# Altium schematic sheet OutputBuffer.SchDoc
size Letter; CompanyName: Ploopy Corporation; Organization: Ploopy Corporation; Address1: Suite 226, 137-1140 Burnhamthorpe Road W; Address2: Mississauga; Address3: Ontario; Address4: Canada L5C 0A3; DocumentNumber: 8; Revision: R1.007; SheetNumber: 8; SheetTotal: 11; SPICEModelCache: <root> / <DocumentId>SDQUHXFI</DocumentId> / </root>
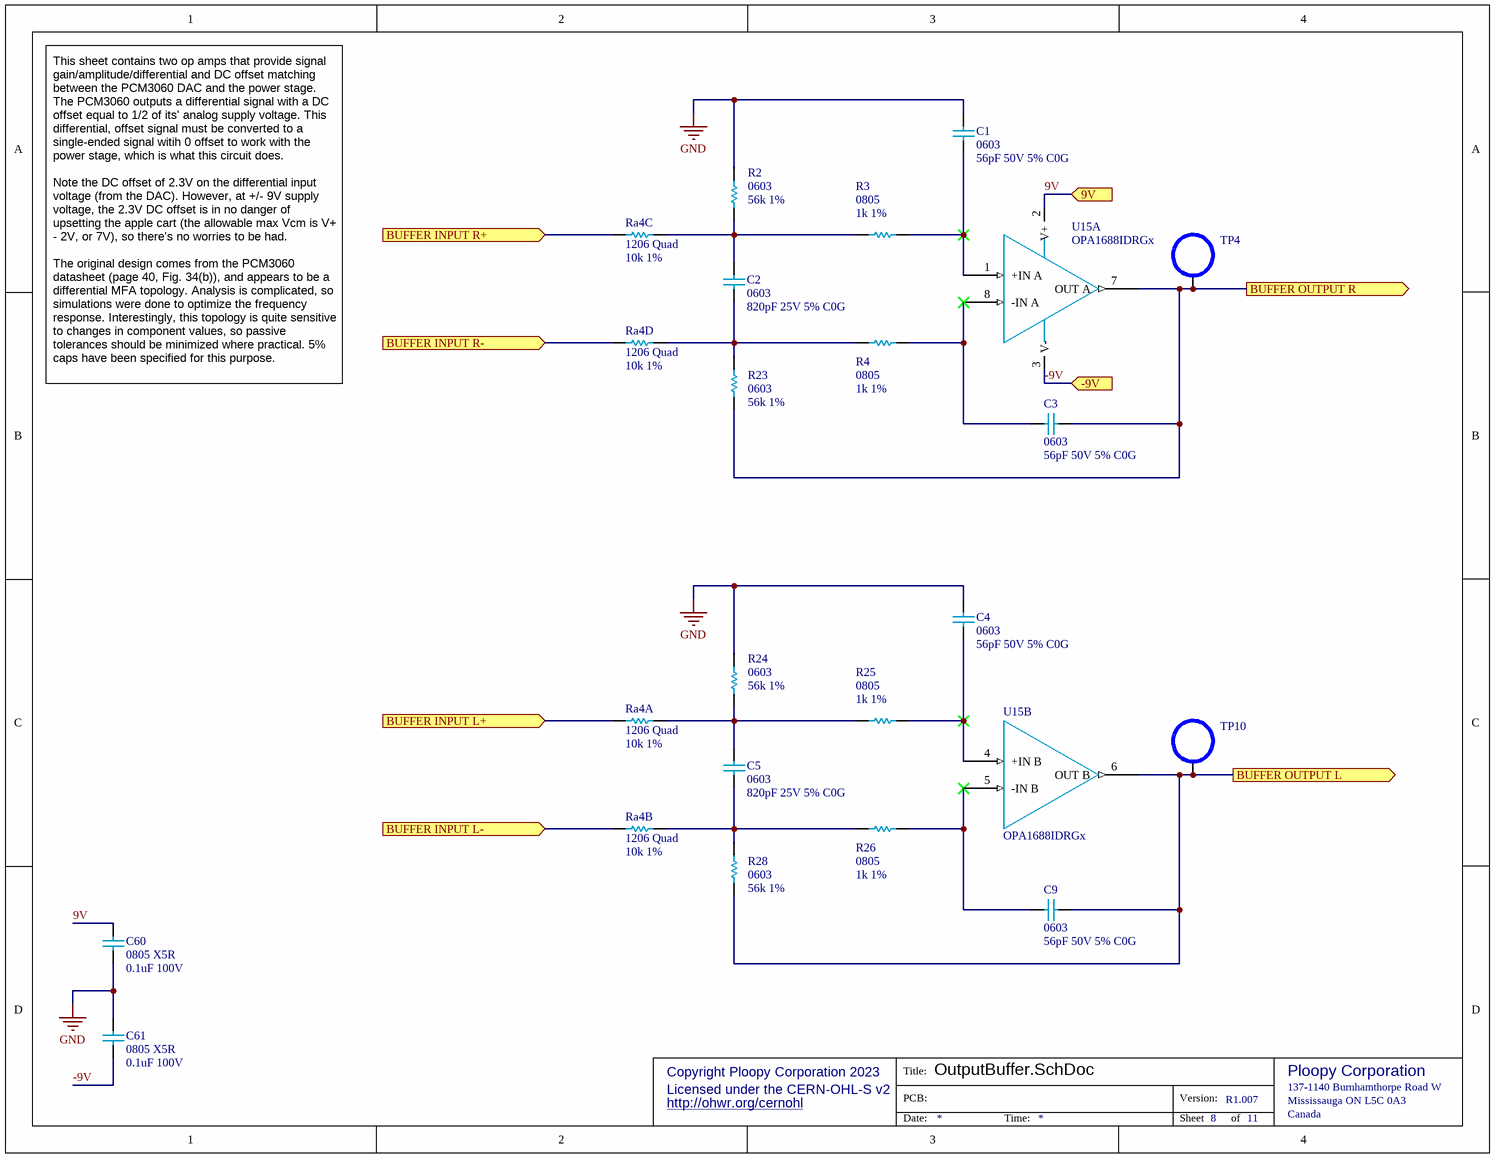
[diagram p0: OutputBuffer.SchDoc]

## Parts
C1  0603  value 56pF 50V 5% C0G  [0603]
C2  0603  value 820pF 25V 5% C0G  [0603]
C3  0603  value 56pF 50V 5% C0G  [0603]
C4  0603  value 56pF 50V 5% C0G  [0603]
C5  0603  value 820pF 25V 5% C0G  [0603]
C9  0603  value 56pF 50V 5% C0G  [0603]
C60  0805 X5R  value 0.1uF 100V  [0805 - TALL]
C61  0805 X5R  value 0.1uF 100V  [0805 - TALL]
R2  0603  value 56k 1%  [0603]
R3  0805  value 1k 1%  [0805]
R4  0805  value 1k 1%  [0805]
R23  0603  value 56k 1%  [0603]
R24  0603  value 56k 1%  [0603]
R25  0805  value 1k 1%  [0805]
R26  0805  value 1k 1%  [0805]
R28  0603  value 56k 1%  [0603]
Ra4  1206 Quad  value 10k 1%  [4x 10k 1% - CAC-80P320X160-8M]  (parts A,B,C,D of 4)
TP4  TestPointHook  [S2751-46R]  (value not drawn)
TP10  TestPointHook  [S2751-46R]  (value not drawn)
U15  OPA1688IDRGx  [OPA1688 - SON50P300X80_HS-9M]  (parts A,B of 2)

## Ports
9V (in), -9V (in), BUFFER INPUT L+ (in), BUFFER INPUT L- (in), BUFFER INPUT R+ (in), BUFFER INPUT R- (in), BUFFER OUTPUT L (out), BUFFER OUTPUT R (out)

## Nets
GND: C1.2 C4.2 C60.1 C61.2 R2.1 R24.1
9V: C60.2 U15.2(V+) ; port 9V
-9V: C61.1 U15.3(V-) ; port -9V
BUFFER INPUT L+: Ra4.1 ; port BUFFER INPUT L+
BUFFER INPUT L-: Ra4.2 ; port BUFFER INPUT L-
BUFFER INPUT R+: Ra4.3 ; port BUFFER INPUT R+
BUFFER INPUT R-: Ra4.4 ; port BUFFER INPUT R-
BUFFER OUTPUT L: C9.2 R28.1 TP10.1 U15.6(OUT_B) ; port BUFFER OUTPUT L
BUFFER OUTPUT R: C3.2 R23.1 TP4.1 U15.7(OUT_A) ; port BUFFER OUTPUT R
NetC1_1: C1.1 R3.2 U15.1(+IN_A)
NetC2_1: C2.1 R4.1 R23.2 Ra4.5
NetC2_2: C2.2 R2.2 R3.1 Ra4.6
NetC3_1: C3.1 R4.2 U15.8(-IN_A)
NetC4_1: C4.1 R25.2 U15.4(+IN_B)
NetC5_1: C5.1 R26.1 R28.2 Ra4.7
NetC5_2: C5.2 R24.2 R25.1 Ra4.8
NetC9_1: C9.1 R26.2 U15.5(-IN_B)

## Notes on the sheet
- This sheet contains two op amps that provide signal gain/amplitude/differential and DC offset matching between the PCM3060 DAC and the power stage. The PCM3060 outputs a differential signal with a DC offset equal to 1/2 of its' analog supply voltage. This differential, offset signal must be converted to a single-ended signal witih 0 offset to work with the power stage, which is what this circuit does.
  Note the DC offset of 2.3V on the differential input voltage (from the DAC). However, at +/- 9V supply voltage, the 2.3V DC offset is in no danger of upsetting the apple cart (the allowable max Vcm is V+ - 2V, or 7V), so there's no worries to be had.
  The original design comes from the PCM3060 datasheet (page 40, Fig. 34(b)), and appears to be a differential MFA topology. Analysis is complicated, so simulations were done to optimize the frequency response. Interestingly, this topology is quite sensitive to changes in component values, so passive tolerances should be minimized where practical. 5% caps have been specified for this purpose.
- Copyright Ploopy Corporation 2023
- Licensed under the CERN-OHL-S v2
- http://ohwr.org/cernohl
- Title:
- PCB:
- Version:
- Ploopy Corporation
- Mississauga ON L5C 0A3
- 137-1140 Burnhamthorpe Road W
- Date:
- Time:
- Sheet
- of
- Canada

## Library data of the parts
C1 C3 C4 C9 = Cap 56pF 50V: 0603, 5% C0G or better
C2 C5 = Cap 820pF 25V: 0603, 5% C0G or better
C60 C61 = Cap 0.1uF 100V: 0805, X5R or better; Supplier 1: Digi-Key; Supplier Part Number 1: 1276-6840-2-ND
R2 R23 R24 R28 = Res 56k 1% 0603: Chip resistor
R3 R4 R25 R26 = Res 1k 1% 0805: Chip resistor, 1/8W 100PPM; Supplier 1: Digi-Key; Supplier Part Number 1: RMCF0805FT1K00TR-ND
Ra4 = Quad Res 10k 1% 1206: Chip resistor
TP4 TP10 = TestPointHook: Test point, SMT ring (micro-hook compatible); Supplier 1: Digi-Key; Supplier Part Number 1: 952-2664-6-ND; Supplier 2: Digi-Key; Supplier Part Number 2: A106144DKR-ND; Supplier 3: Arrow; Supplier Part Number 3: z_4zPAhGJpPHHYBcC24zmONEz5elv0VZALWfNkICq0w
U15 = OPA1688IDRGx: 36V, 10MHz, Low Distortion High Drive Rail-to-Rail Output Audio Operational Amplifiers; Supplier 1: Arrow Electronics; Supplier 2: Mouser; Supplier Part Number 2: 595-OPA1688IDRGR; Supplier Part Number 1: OPA1688IDRGR